# Altium schematic sheet Analog to Digital Con.SchDoc
size A
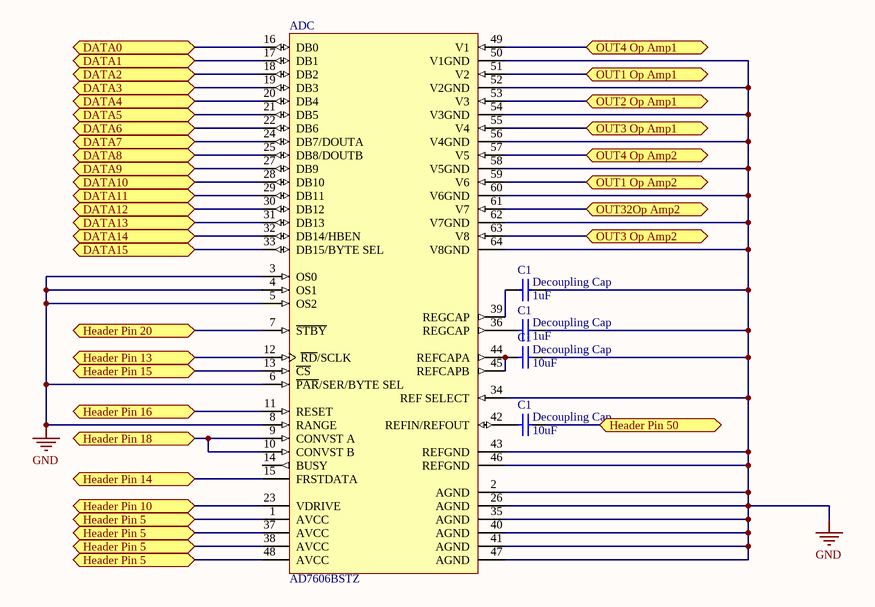
[diagram p0: Analog to Digital Con.SchDoc]

## Parts
(Parts that share a designator on the sheet are numbered #1, #2 ... from top to bottom, then left to right.)
ADC  AD7606BSTZ  [ST-64-2_N]
C1#1  Decoupling Cap  value 1uF  [C1206]
C1#2  Decoupling Cap  value 1uF  [C1206]
C1#3  Decoupling Cap  value 10uF  [C1206]
C1#4  Decoupling Cap  value 10uF  [C1206]

## Ports
DATA0, DATA1, DATA2, DATA3, DATA4, DATA5, DATA6, DATA7, DATA8, DATA9, DATA10, DATA11, DATA12, DATA13, DATA14, DATA15, Header Pin 5, Header Pin 10, Header Pin 13, Header Pin 14, Header Pin 15, Header Pin 16, Header Pin 18, Header Pin 20, Header Pin 50, OUT1 Op Amp1, OUT1 Op Amp2, OUT2 Op Amp1, OUT3 Op Amp1, OUT3 Op Amp2, OUT4 Op Amp1, OUT4 Op Amp2, OUT32Op Amp2

## Nets
GND: ADC.2(AGND) ADC.3(OS0) ADC.4(OS1) ADC.5(OS2) ADC.6(~{PAR}/SER/BYTE_SEL) ADC.8(RANGE) ADC.26(AGND) ADC.34(REF_SELECT) ADC.35(AGND) ADC.40(AGND) ADC.41(AGND) ADC.43(REFGND) ADC.46(REFGND) ADC.47(AGND) ADC.50(V1GND) ADC.52(V2GND) ADC.54(V3GND) ADC.56(V4GND) ADC.58(V5GND) ADC.60(V6GND) ADC.62(V7GND) ADC.64(V8GND) C1#1.1 C1#2.1 C1#3.1
DATA0: ADC.16(DB0) ; port DATA0
DATA1: ADC.17(DB1) ; port DATA1
DATA2: ADC.18(DB2) ; port DATA2
DATA3: ADC.19(DB3) ; port DATA3
DATA4: ADC.20(DB4) ; port DATA4
DATA5: ADC.21(DB5) ; port DATA5
DATA6: ADC.22(DB6) ; port DATA6
DATA7: ADC.24(DB7/DOUTA) ; port DATA7
DATA8: ADC.25(DB8/DOUTB) ; port DATA8
DATA9: ADC.27(DB9) ; port DATA9
DATA10: ADC.28(DB10) ; port DATA10
DATA11: ADC.29(DB11) ; port DATA11
DATA12: ADC.30(DB12) ; port DATA12
DATA13: ADC.31(DB13) ; port DATA13
DATA14: ADC.32(DB14/HBEN) ; port DATA14
DATA15: ADC.33(DB15/BYTE_SEL) ; port DATA15
Header Pin 5: ADC.1(AVCC) ADC.37(AVCC) ADC.38(AVCC) ADC.48(AVCC) ; port Header Pin 5
Header Pin 10: ADC.23(VDRIVE) ; port Header Pin 10
Header Pin 13: ADC.12(~{RD}/SCLK) ; port Header Pin 13
Header Pin 14: ADC.15(FRSTDATA) ; port Header Pin 14
Header Pin 15: ADC.13(~{CS}) ; port Header Pin 15
Header Pin 16: ADC.11(RESET) ; port Header Pin 16
Header Pin 18: ADC.9(CONVST_A) ADC.10(CONVST_B) ; port Header Pin 18
Header Pin 20: ADC.7(~{STBY}) ; port Header Pin 20
Header Pin 50: C1#4.1 ; port Header Pin 50
OUT1 Op Amp1: ADC.51(V2) ; port OUT1 Op Amp1
OUT1 Op Amp2: ADC.59(V6) ; port OUT1 Op Amp2
OUT2 Op Amp1: ADC.53(V3) ; port OUT2 Op Amp1
OUT3 Op Amp1: ADC.55(V4) ; port OUT3 Op Amp1
OUT3 Op Amp2: ADC.63(V8) ; port OUT3 Op Amp2
OUT4 Op Amp1: ADC.49(V1) ; port OUT4 Op Amp1
OUT4 Op Amp2: ADC.57(V5) ; port OUT4 Op Amp2
OUT32Op Amp2: ADC.61(V7) ; port OUT32Op Amp2
NetADC_36: ADC.36(REGCAP) C1#2.2
NetADC_39: ADC.39(REGCAP) C1#1.2
NetADC_42: ADC.42(REFIN/REFOUT) C1#4.2
NetADC_44: ADC.44(REFCAPA) ADC.45(REFCAPB) C1#3.2

Not connected (* = marked no-connect by the designer): ADC 14(BUSY)

## Library data of the parts
ADC = AD7606BSTZ: 8 Channel Data Acquisition System with 16-Bit, Bipolar Input, Simultaneous Sampling Analog-to-Digital Converter with Parallel, Serial and SPI Interface, 200KSPS, -40 to +85 degC, ST-64-2, Pb-Free, Tray; Generic Part Number: AD7606; Manufacturer: Analog Devices; Resolution (Bits): 16; Channels: 8; Throughput Rate (SPS): 200K; Interface: Par, Ser, SPI; DatasheetVersion: Rev.C; PackageVersion: 051706-A; PackageReference: ST-64-2; PackageDescription: 64-Lead Low Profile Quad Flat Package [LQFP]; Supplier 1: Digi-Key; Supplier Part Number 1: AD7606BSTZ-ND; Supplier 2: Farnell; Supplier Part Number 2: 1864685; Supplier 3: Newark; Supplier Part Number 3: 76R7614; Supplier 4: Mouser; Supplier Part Number 4: 584-AD7606BSTZ; RoHS: Y; Packing: Tray; Mounting Technology: Surface Mount; Code_JEDEC: MS-026-BCD; PartNumber: AD7606BSTZ; ComponentLink1Description: Manufacturer URL; ComponentLink1URL: http://www.analog.com/en/index.html; ComponentLink2Description: Datasheet; ComponentLink2URL: http://www.analog.com/static/imported-files/data_sheets/AD7606_7606-6_7606-4.pdf; ComponentLink3Description: Package Specification; ComponentLink3URL: http://www.analog.com/static/imported-files/packages/PKG_PDF/LQFP%28ST%29/ST_64_2.pdf; ComponentLink4Description: Product URL; ComponentLink4URL: http://www.analog.com/en/analog-to-digital-converters/ad-converters/ad7606/products/product.html
C1#1-C1#4 = Cap Semi: Capacitor (Semiconductor SIM Model); Published: 8-Jun-2000; LatestRevisionDate: 29-May-2009; LatestRevisionNote: IPC-7351 Footprint Added.; PackageReference: C1206; Publisher: Altium Limited; PackageDescription: Chip Capacitor